# Altium schematic sheet Sheet1.SchDoc
size A
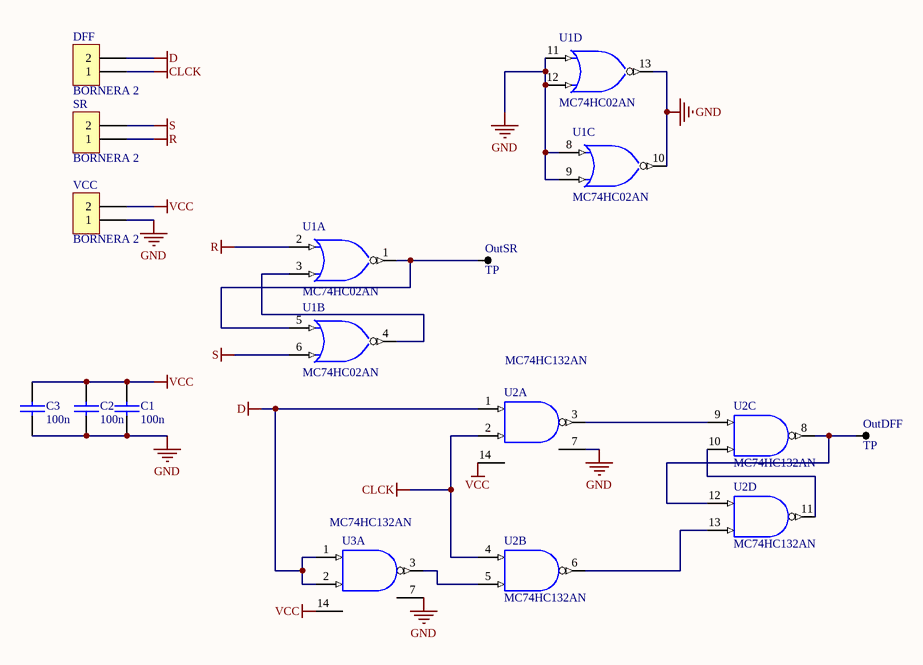
[diagram p0: Sheet1.SchDoc]

## Parts
C1  100n  [0805]
C2  100n  [0805]
C3  100n  [0805]
DFF  BORNERA 2  [BORNERA2]
OutDFF  TP  [TPTH]
OutSR  TP  [TPTH]
SR  BORNERA 2  [BORNERA2]
U1  MC74HC02AN  [646-06]  (parts A,B,C,D of 4)
U2  MC74HC132AN  [646-06]  (parts A,B,C,D of 4)
U3  MC74HC132AN  [646-06]  (part A of 4)
VCC  BORNERA 2  [BORNERA2]

## Nets
CLCK: DFF.1 U2.2(B) U2.4(A)
D: DFF.2 U2.1(A) U3.1(A) U3.2(B)
GND: C1.2 C2.2 C3.2 U1.7(GND) U1.8(A) U1.9(B) U1.10(~{Y}) U1.11(A) U1.12(B) U1.13(~{Y}) U2.7(GND) U3.7(GND) VCC.1
R: SR.1 U1.2(A)
S: SR.2 U1.6(B)
VCC: C1.1 C2.1 C3.1 U1.14(VCC) U2.14(VDD) U3.14(VDD) VCC.2  [also labelled VDD]
NetOutDFF_1: OutDFF.1 U2.8(Y) U2.12(A)
NetOutSR_1: OutSR.1 U1.1(~{Y}) U1.5(A)
NetU1_3: U1.3(B) U1.4(~{Y})
NetU2_3: U2.3(Y) U2.9(A)
NetU2_5: U2.5(B) U3.3(Y)
NetU2_6: U2.6(Y) U2.13(B)
NetU2_10: U2.10(B) U2.11(Y)

## Library data of the parts
C1-C3 = CAP
U1 = MC74HC02AN: Quad 2-Input NOR Gate; Published: 15-Apr-2002; DatasheetVersion: Mar-2000; PackageVersion: 1995; PackageReference: 646-06; Publisher: Altium Limited; PackageDescription: DIP; 14 Leads; Row Spacing 7.62 mm; Pitch 2.54 mm; ComponentLink1Description: Manufacturer Link; ComponentLink1URL: http://www.onsemi.com/; ComponentLink2Description: Datasheet; ComponentLink2URL: http://www.onsemi.com/pub/Collateral/MC74HC02A-D.PDF
U2 U3 = MC74HC132AN: Quad 2-Input NAND Gate with Schmitt Trigger Inputs; Published: 15-Apr-2002; DatasheetVersion: Mar-2000; PackageVersion: 1995; PackageReference: 646-06; Publisher: Altium Limited; PackageDescription: DIP; 14 Leads; Row Spacing 7.62 mm; Pitch 2.54 mm; ComponentLink1Description: Manufacturer Link; ComponentLink1URL: http://www.onsemi.com/; ComponentLink2Description: Datasheet; ComponentLink2URL: http://www.onsemi.com/pub/Collateral/MC74HC132A-D.PDF